# EAGLE design PlanktoscopeHat-v0.2-fab (EAGLE 9.6.2)
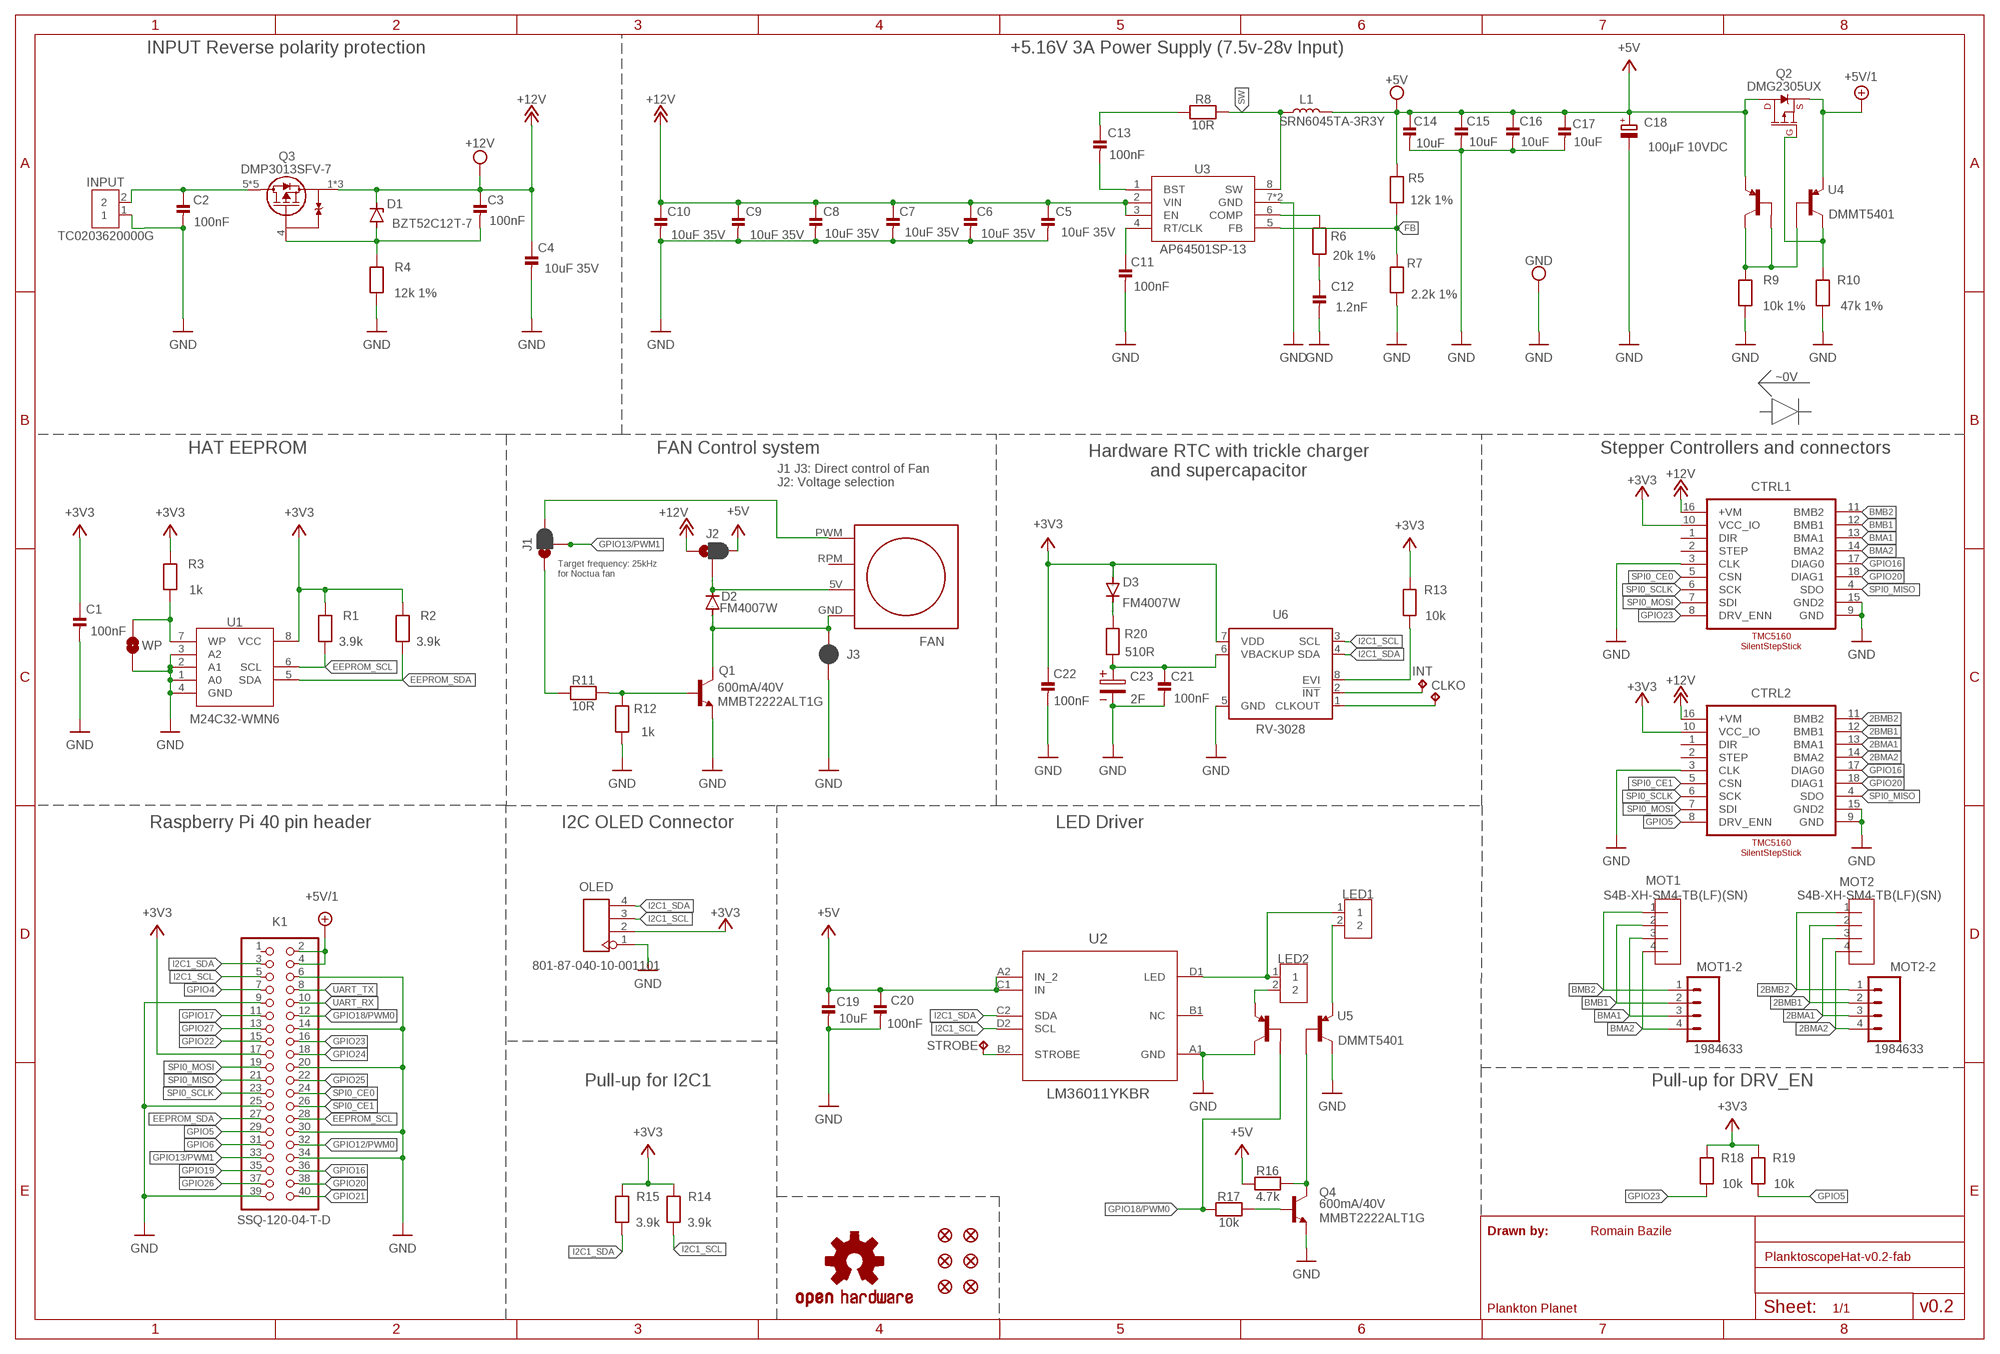
[diagram p0: schematic, sheet 1]

## Parts
+5V  TESTPOINTPAD2MM  [TESTPOINT_PAD_2MM]
+12V  TESTPOINTPAD2MM  [TESTPOINT_PAD_2MM]
C1  100nF  CAP_CERAMIC_0805MP  [_0805MP]
C2  100nF  CAP_CERAMIC_0805MP  [_0805MP]
C3  100nF  CAP_CERAMIC_0805MP  [_0805MP]
C4  10uF 35V  CAP_CERAMIC_0805MP  [_0805MP]
C5  10uF 35V  CAP_CERAMIC_0805MP  [_0805MP]
C6  10uF 35V  CAP_CERAMIC_0805MP  [_0805MP]
C7  10uF 35V  CAP_CERAMIC_0805MP  [_0805MP]
C8  10uF 35V  CAP_CERAMIC_0805MP  [_0805MP]
C9  10uF 35V  CAP_CERAMIC_0805MP  [_0805MP]
C10  10uF 35V  CAP_CERAMIC_0805MP  [_0805MP]
C11  100nF  CAP_CERAMIC_0805MP  [_0805MP]
C12  1.2nF  CAP_CERAMIC_0805MP  [_0805MP]
C13  100nF  CAP_CERAMIC_0805MP  [_0805MP]
C14  10uF  CAP_CERAMIC_0805MP  [_0805MP]
C15  10uF  CAP_CERAMIC_0805MP  [_0805MP]
C16  10uF  CAP_CERAMIC_0805MP  [_0805MP]
C17  10uF  CAP_CERAMIC_0805MP  [_0805MP]
C18  100µF 10VDC  C-POL_TANTALUM-2412(6032-METRIC)  [CAPMP6032X280N]
C19  10uF  CAP_CERAMIC_0805MP  [_0805MP]
C20  100nF  CAP_CERAMIC_0805MP  [_0805MP]
C21  100nF  CAP_CERAMIC_0805MP  [_0805MP]
C22  100nF  CAP_CERAMIC_0805MP  [_0805MP]
C23  2F  WCAP-PTHT_8X8_870135174001  [8X3.5X0.9(DXAXB)]
CLKO  TPB1,27  [B1,27]
CTRL1  TMC5160_SILENTSTEPSTICK  [TMC5160_STEPSTICK]
CTRL2  TMC5160_SILENTSTEPSTICK  [TMC5160_STEPSTICK]
D1  BZT52C12T-7  ZENER_SODFL(1608-METRIC)  [SODFL1608X70]
D2  FM4007W  DIODE-DO-214AC  [DO-214AC]
D3  FM4007W  DIODE-DO-214AC  [DO-214AC]
FAN  40MM_FAN  [40MM_FAN]
FD1  FIDUCIAL1X2  [FIDUCIAL-1X2]
FD2  FIDUCIAL1X2  [FIDUCIAL-1X2]
FD3  FIDUCIAL1X2  [FIDUCIAL-1X2]
FD4  FIDUCIAL1X2  [FIDUCIAL-1X2]
FD5  FIDUCIAL1X2  [FIDUCIAL-1X2]
FD6  FIDUCIAL1X2  [FIDUCIAL-1X2]
GND  TESTPOINTPAD2MM  [TESTPOINT_PAD_2MM]
INPUT  TC0203620000G  2828XX-2282837-2  [TERMBLK_508-2N]
INT  TPB1,27  [B1,27]
J1  JUMPER-SMT_3_1-NC_PASTE_SILK  [SMT-JUMPER_3_1-NC_PASTE_SILK]
J2  JUMPER-SMT_3_1-NC_PASTE_SILK  [SMT-JUMPER_3_1-NC_PASTE_SILK]
J3  JUMPER-SMT_2_NC_PASTE_SILK  [SMT-JUMPER_2_NC_PASTE_SILK]
K1  SSQ-120-04-T-D  PINHD-2X20  [2X20]
L1  SRN6045TA-3R3Y  INDUCTOR-SRN6045-33UH  [SRN6045]
LED1  2828XX-2282834-2  [TERMBLK_254-2N]
LED2  2828XX-2282834-2  [TERMBLK_254-2N]
LOGO1  OSHW-LOGOL  [OSHW-LOGO-L]
MOT1  S4B-XH-SM4-TB(LF)(SN)  [CONN_S4B-XH-SM4-TB_JST]
MOT1-2  1984633  CONN_04SCREW  [SCREWTERMINAL-3.5MM-4]
MOT2  S4B-XH-SM4-TB(LF)(SN)  [CONN_S4B-XH-SM4-TB_JST]
MOT2-2  1984633  CONN_04SCREW  [SCREWTERMINAL-3.5MM-4]
OLED  801-87-040-10-001101  DIP-BLACK-MALE-HEADER-VERT(4P-2.54)  [H4-2.54]
Q1  600mA/40V  TRANS_NPN-MMBT2222AL  [SOT23-3]
Q2  DMG2305UX  MOSFET_PCH-DMG2305UX-7  [SOT23-3]
Q3  DMP3013SFV-7  [POWERDI3333-8_UX_DIO]
Q4  600mA/40V  TRANS_NPN-MMBT2222AL  [SOT23-3]
R1  3.9k  RESISTOR_0805MP  [_0805MP]
R2  3.9k  RESISTOR_0805MP  [_0805MP]
R3  1k  RESISTOR_0805MP  [_0805MP]
R4  12k 1%  RESISTOR_0805MP  [_0805MP]
R5  12k 1%  RESISTOR_0805MP  [_0805MP]
R6  20k 1%  RESISTOR_0805MP  [_0805MP]
R7  2.2k 1%  RESISTOR_0805MP  [_0805MP]
R8  10R  RESISTOR_0805MP  [_0805MP]
R9  10k 1%  RESISTOR_0805MP  [_0805MP]
R10  47k 1%  RESISTOR_0805MP  [_0805MP]
R11  10R  RESISTOR_0805MP  [_0805MP]
R12  1k  RESISTOR_0805MP  [_0805MP]
R13  10k  RESISTOR_0805MP  [_0805MP]
R14  3.9k  RESISTOR_0805MP  [_0805MP]
R15  3.9k  RESISTOR_0805MP  [_0805MP]
R16  4.7k  RESISTOR_0805MP  [_0805MP]
R17  10k  RESISTOR_0805MP  [_0805MP]
R18  10k  RESISTOR_0805MP  [_0805MP]
R19  10k  RESISTOR_0805MP  [_0805MP]
R20  510R  RESISTOR_0805MP  [_0805MP]
STROBE  TPTP15R  [TP15R]
U1  M24C32-WMN6  [SO-8_STM]
U2  LM36011YKBR  [YKB0008AGAG]
U3  AP64501SP-13  AP64500SP-13  [SO-8EP_DIO]
U4  DMMT5401  DDMT5401  [SOT26]
U5  DMMT5401  DDMT5401  [SOT26]
U6  RV-3028  [RV-3028]
WP  JUMPER-SMT_2_NO_SILK  [SMT-JUMPER_2_NO_SILK]

## Nets
2BMA1: CTRL2.13(BMA1) MOT2-2.3 MOT2.3
2BMA2: CTRL2.14(BMA2) MOT2-2.4 MOT2.4
2BMB1: CTRL2.12(BMB1) MOT2-2.2 MOT2.2
2BMB2: CTRL2.11(BMB2) MOT2-2.1 MOT2.1
+3V3: C1.1 C22.1 CTRL1.10(VCC_IO) CTRL2.10(VCC_IO) D3.A K1.17 OLED.2 R1.2 R2.2 R3.2 R13.2 R14.2 R15.2 R18.2 R19.2 U1.8(VCC) U6.7(VDD)
+5V: +5V.P$1 C14.1 C15.1 C16.1 C17.1 C18.1(+) C19.1 C20.1 J2.3 L1.2 Q2.3(D) R5.2 R16.2 U2.A2(IN_2) U2.C1(IN) U4.D1
+5V/1: K1.2 K1.4 Q2.2(S) U4.S1
+12V: +12V.P$1 C3.1 C4.1 C5.1 C6.1 C7.1 C8.1 C9.1 C10.1 CTRL1.16(+VM) CTRL2.16(+VM) D1.1(C) J2.1 Q3.1(S) Q3.2(S) Q3.3(S) U3.2(VIN) U3.3(EN)
/GPIO18: Q4.3(C) R16.1 U5.G2
/INT: INT.TP U6.2(!INT)
BMA1: CTRL1.13(BMA1) MOT1-2.3 MOT1.3
BMA2: CTRL1.14(BMA2) MOT1-2.4 MOT1.4
BMB1: CTRL1.12(BMB1) MOT1-2.2 MOT1.2
BMB2: CTRL1.11(BMB2) MOT1-2.1 MOT1.1
BST: C13.2 U3.1(BST)
CLKOUT: CLKO.TP U6.1(CLKOUT)
COMP: R6.2 U3.6(COMP)
EEPROM_SCL: K1.28 R1.1 U1.6(SCL)
EEPROM_SDA: K1.27 R2.1 U1.5(SDA)
FB: R5.1 R7.2 U3.5(FB)
GND: C1.2 C2.2 C4.2 C5.2 C6.2 C7.2 C8.2 C9.2 C10.2 C11.2 C12.2 C14.2 C15.2 C16.2 C17.2 C18.2(-) C19.2 C20.2 C21.2 C22.2 C23.2 CTRL1.3(CLK) CTRL1.9(GND) CTRL1.15(GND2) CTRL2.3(CLK) CTRL2.9(GND) CTRL2.15(GND2) GND.P$1 INPUT.1 J3.1 K1.6 K1.9 K1.14 K1.20 K1.25 K1.30 K1.34 K1.39 OLED.1 Q1.2(E) Q4.2(E) R4.1 R7.1 R9.1 R10.1 R12.1 U1.1(A0) U1.2(A1) U1.3(A2) U1.4(GND) U2.A1(GND) U3.7(GND) U3.EPAD(GND) U5.D2 U5.G1 U6.5(GND) WP.1
GPIO4: K1.7
GPIO5: CTRL2.8(DRV_ENN) K1.29 R19.1
GPIO6: K1.31
GPIO12/PWM0: K1.32
GPIO13/PWM1: J1.2 K1.33
GPIO16: CTRL1.17(DIAG0) CTRL2.17(DIAG0) K1.36
GPIO17: K1.11
GPIO18/PWM0: K1.12 R17.1 U5.S2
GPIO19: K1.35
GPIO20: CTRL1.18(DIAG1) CTRL2.18(DIAG1) K1.38
GPIO21: K1.40
GPIO22: K1.15
GPIO23: CTRL1.8(DRV_ENN) K1.16 R18.1
GPIO24: K1.18
GPIO25: K1.22
GPIO26: K1.37
GPIO27: K1.13
I2C1_SCL: K1.5 OLED.3 R14.1 U2.D2(SCL) U6.3(SCL)
I2C1_SDA: K1.3 OLED.4 R15.1 U2.C2(SDA) U6.4(SDA)
LED: LED1.1 LED2.1 U2.D1(LED)
LED1OUT: LED1.2 U5.S1
LED2OUT: LED2.2 U5.D1
N$3: R3.1 U1.7(WP) WP.2
N$5: STROBE.TP U2.B2(STROBE)
N$6: C3.2 D1.2(A) Q3.4(G) R4.2
N$8: D2.A FAN.GND J3.2 Q1.3(C)
N$10: C13.1 R8.2
N$12: Q2.1(G) R10.2 U4.D2
N$14: C12.1 R6.1
N$15: R9.2 U4.G1 U4.G2 U4.S2
N$16: D2.C FAN.5V(+5V) J2.2
N$17: Q1.1(B) R11.2 R12.2
N$18: J1.1 R11.1
N$19: FAN.PWM J1.3
N$20: D3.C R20.2
N$21: R13.1 U6.8(EVI)
N$25: Q4.1(B) R17.2
RT: C11.1 U3.4(RT/CLK)
SPI0_CE0: CTRL1.5(CSN) K1.24
SPI0_CE1: CTRL2.5(CSN) K1.26
SPI0_MISO: CTRL1.4(SDO) CTRL2.4(SDO) K1.21
SPI0_MOSI: CTRL1.7(SDI) CTRL2.7(SDI) K1.19
SPI0_SCLK: CTRL1.6(SCK) CTRL2.6(SCK) K1.23
SW: L1.1 R8.1 U3.8(SW)
UART_RX: K1.10
UART_TX: K1.8
VBACKUP: C21.1 C23.1 R20.1 U6.6(VBACKUP)
VIN: C2.1 INPUT.2 Q3.5(D) Q3.6(D) Q3.7(D) Q3.8(D) Q3.9(D)
Unconnected: CTRL1.1(DIR) CTRL1.2(STEP) CTRL2.1(DIR) CTRL2.2(STEP) FAN.RPM K1.1 U2.B1(NC)

## Notes on the sheet
- INPUT Reverse polarity protection | +5.16V 3A Power Supply (7.5v-28v Input)
- ~0V
- HAT EEPROM | FAN Control system | Stepper Controllers and connectors
- Hardware RTC with trickle charger
  and supercapacitor
- J1 J3: Direct control of Fan
  J2: Voltage selection
- Target frequency: 25kHz
  for Noctua fan
- Raspberry Pi 40 pin header | I2C OLED Connector | LED Driver
- Pull-up for I2C1 | Pull-up for DRV_EN
- Drawn by: | Romain Bazile
- Plankton Planet | v0.2

## Library data of the parts
+5V +12V GND = microbuilder:TESTPOINT: Test Point Various test points for characterisation and PCB testing TESTPOINT_SMT - Compact Surface Mount Test Point [Digikey: 5016KTR-ND]
C1-C17 C19-C22 = microbuilder:CAP_CERAMIC: Ceramic Capacitors For new designs, use the packages preceded by an '_' character since they are more reliable: The following footprints should be used on most boards: _0402 - Standard footprint for regular board layouts _0603 - Standard footprint for regular board layouts _0805 - Standard footprint for regular board layouts _1206 - Standard footprint for regular board layouts For extremely tight-pitch boards where space is at a premium, the following 'micro-pitch' footprints can be used (smaller pads, no silkscreen outline, etc.): _0402MP - Micro-pitch footprint for very dense/compact boards _0603MP - Micro-pitch footprint for very dense/compact boards _0805MP - Micro-pitch footprint for very dense/compact boards _1206MP - Micro-pitch footprint for very dense/compact boards
C18 = Capacitor:C-POL: Capacitor Polarised - Generic; CATEGORY: Capacitor; MPN: TPSC107K010T0200
C23 = Wurth_Elektronik_Passive_Capacitors_rev19a:WCAP-PTHT: WCAP-PTHT Aluminum Polymer Capacitors Characteristics Aluminum Polymer Capacitor Recommended soldering: Wave Operating temperature: -55°C to +125°C +125°C product series Low ESR at high frequency range Long life: 2000h @ +125°C Package name and Variant abbreviation: Package: D X A X B = Diameter of the outline X Pitch of the hole X Diameter of the hole. <http://katalog.we-online.de/media/images/eisos/WCAP-PTHT_pf2.jpg> Details see: http://katalog.we-online.de/en/pbs/WCAP-PTHT/ Created: 2015-02-06 2015 (C) Wurth Elektronik; MPN: SCCR12E105SRB; WE-NUMBER: 870135174001/390uF
CLKO INT STROBE = testpad:TP: Test pad
CTRL1 CTRL2 = PScope:TMC5160_SILENTSTEPSTICK
D1 = Diode:ZENER: Zener Diode - Generic; CATEGORY: Diode; SUB-CATEGORY: Zener; VALUE: ZENER
D2 D3 = diode:DIODE-: DIODE
FAN = PScope:40MM_FAN
FD1-FD6 = SparkFun-Aesthetics:FIDUCIAL: Fiducial Alignment Points Point-of-reference for pick-and-place machines and other optical instruments.
INPUT = Connector:2828XX-2: 2 Position Wire to Board Terminal Block Horizontal with Board Datasheet <https://www.te.com.cn/commerce/DocumentDelivery/DDEController?Action=showdoc&DocId=Catalog+Section%7F1308389_EUROSTYLE_TERMINAL_BLOCKS%7F0607%7Fpdf%7FEnglish%7FENG_CS_1308389_EUROSTYLE_TERMINAL_BLOCKS_0607.pdf%7F2-282837-5>; CATEGORY: Connector; DESCRIPTION: 2 Position Wire to Board Terminal Block Horizontal with Board 5.08 mm Through Hole; MANUFACTURER: TE Connectivity; MPN: TC0203620000G; OPERATING_TEMPERATURE: -40°C to +105°C; PART_STATUS: ACTIVE; ROHS_COMPLIANCE: RoHS Compliant; SERIES: 282837; SUBCATEGORY: Terminal Block; TYPE: Side Wire Entry
J1 J2 = SparkFun-Jumpers:JUMPER-SMT_3_1-NC_PASTE: Normally closed solder jumper (1 of 2 connections) This jumper has an aperture in the stencil to allow solder paste to bridge one of the two connections. One connection is normally closed (NC), while the other is normally open (NO). Wick off the solder to open the connection. Reapply solder to reclose the connection. Apply solder to the other side instead to change the current path.
J3 = SparkFun-Jumpers:JUMPER-SMT_2_NC_PASTE: Normally closed solder jumper This jumper has an aperture in the stencil to allow solder paste to bridge the split in the wire so it's normally closed (NC). Wick off the solder to open the connection. Reapply solder to reclose the connection.
K1 = Connector:PINHD-2X20: PIN HEADER; CATEGORY: CONNECTOR; SUB-CATEGORY: PIN-HEADER
L1 = SparkFun-Coils:INDUCTOR: Inductors Resist changes in electrical current. Basically a coil of wire. SparkFun Products: SparkFun Load Cell Amplifier - HX711 <https://www.sparkfun.com/products/13879> IOIO-OTG - V2.2 <https://www.sparkfun.com/products/13613>; PROD_ID: NDUC-11627; VALUE: 33µH/±20%/1.4A
LED1 LED2 = Connector:2828XX-2: 2 Position Wire to Board Terminal Block Horizontal with Board Datasheet <https://www.te.com.cn/commerce/DocumentDelivery/DDEController?Action=showdoc&DocId=Catalog+Section%7F1308389_EUROSTYLE_TERMINAL_BLOCKS%7F0607%7Fpdf%7FEnglish%7FENG_CS_1308389_EUROSTYLE_TERMINAL_BLOCKS_0607.pdf%7F2-282837-5>
LOGO1 = SparkFun-Aesthetics:OSHW-LOGO: Open-Source Hardware (OSHW) Logo This logo indicates the piece of hardware it is found on incorporates a OSHW license and/or adheres to the definition of open source hardware found here: http://freedomdefined.org/OSHW
MOT1 MOT2 = PScope:S4B-XH-SM4-TB(LF)(SN); BUILT_BY: EMA_Justin; COPYRIGHT: Copyright (C) 2018 Accelerated Designs. All rights reserved; DATASHEET: http://www.farnell.com/datasheets/1684882.pdf?_ga=2.23206330.1695985900.1582574926-861621671.1572890216&_gac=1.58313304.1582574926.CjwKCAiAhc7yBRAdEiwAplGxX0eXyKiGfj62eRMGG7KvwS8fdWH6vWjmriwTUSfyzPNlkVLVCkx_YhoCwGcQAvD_BwE; MANUFACTURER_PART_NUMBER: S4B-XH-SM4-TB(LF)(SN); MPN: S4B-XH-SM4-TB(LF)(SN); SOURCELIBRARY: JST_2020-02-24; VENDOR: JST
MOT1-2 MOT2-2 = SparkFun-Connectors:CONN_04: Multi connection point. Often used as Generic Header-pin footprint for 0.1 inch spaced/style header connections On any of the 0.1 inch spaced packages, you can populate with these: Break Away Headers - Straight <https://www.sparkfun.com/products/116> (PRT-00116) Break Away Male Headers - Right Angle <https://www.sparkfun.com/products/553> (PRT-00553) Female Headers <https://www.sparkfun.com/products/115> (PRT-00115) Break Away Headers - Machine Pin <https://www.sparkfun.com/products/117> (PRT-00117) Break Away Female Headers - Swiss Machine Pin <https://www.sparkfun.com/products/743> (PRT-00743) For SCREWTERMINALS and SPRING TERMINALS visit here: Screw Terimnals on SparkFun.com <https://www.sparkfun.com/search/results?term=Screw+Terminals> (5mm/3.5mm/2.54mm spacing) This device is also useful as a general connection point to wire up your design to another part of your project. Our various solder wires solder well into these plated through hole pads. Hook-Up Wire - Assortment (Stranded, 22 AWG) <https://www.sparkfun.com/products/11375> (PRT-11375) Hook-Up Wire - Assortment (Solid Core, 22 AWG) <https://www.sparkfun.com/products/11367> (PRT-11367) View the entire wire category on our website here <https://www.sparkfun.com/categories/141> Special notes: Molex polarized connector foot print use with SKU : PRT-08231 with associated crimp pins and housings. 1MM SMD Version SKU: PRT-10208; PROD_ID: 2xCONN-08399; SF_ID: 2xPRT-08084
OLED = OPL_Connector:DIP-BLACK-MALE-HEADER-VERT(4P-2.54): 320020017; MPN: P125-1104A0BS116A1; VALUE: 4p-2.54
Q1 Q4 = SparkFun-DiscreteSemi:TRANS_NPN: NPN transistor Current controlled devices typically used to amplify current or used as a switch. BC547 - COM-08928 <http://www.sparkfun.com/products/8928> (TO-92 45V 100mA) (1.Collector 2.Base 3.Emitter) 2N3904 - COM-00521 <http://www.sparkfun.com/products/521> (TO-92 40V 200mA) (1.Emitter 2.Base 3.Collector) P2N2222A - COM-12852 <http://www.sparkfun.com/products/12852> (TO-92 40V 600mA) (1.Collector 2.Base 3.Emitter); MPN: MMBT2222ALT1G; PROD_ID: TRANS-08049
Q2 = SparkFun-DiscreteSemi:MOSFET_PCH: P-channel MOSFETs Voltage controlled devices that allow control of high current outputs. SparkFun Products: SparkFun ESP32 Thing <https://www.sparkfun.com/products/13907> SparkFun ESP8266 Thing <https://www.sparkfun.com/products/13231> SparkFun Pi Servo HAT V2 <https://www.sparkfun.com/products/15316> DMG2305UX-7 (20V/4.2A/SOT23-3); PROD_ID: TRAN-14388; VALUE: 20V/4.2A/52mΩ/1.4W
Q3 = PScope:DMP3013SFV-7; BUILT_BY: EMA_Cory; COPYRIGHT: Copyright (C) 2018 Accelerated Designs. All rights reserved; DATASHEET: https://www.diodes.com/assets/Datasheets/DMP3013SFV.pdf; MANUFACTURER_PART_NUMBER: DMP3013SFV-7; SOURCELIBRARY: Diodes_Inc_2020-06-18; VENDOR: Diodes Inc
R1-R20 = microbuilder:RESISTOR: Resistors For new designs, use the packages preceded by an '_' character since they are more reliable: The following footprints should be used on most boards: _0402 - Standard footprint for regular board layouts _0603 - Standard footprint for regular board layouts _0805 - Standard footprint for regular board layouts _1206 - Standard footprint for regular board layouts For extremely tight-pitch boards where space is at a premium, the following 'micro-pitch' footprints can be used (smaller pads, no silkscreen outline, etc.): _0402MP - Micro-pitch footprint for very dense/compact boards _0603MP - Micro-pitch footprint for very dense/compact boards _0805MP - Micro-pitch footprint for very dense/compact boards _1206MP - Micro-pitch footprint for very dense/compact boards
U1 = PScope:M24C32-WMN6; BUILT_BY: EMA_UL_Team; MANUFACTURER_PART_NUMBER: M24C32-WMN6; SOURCELIBRARY: StMicro_2011-06-07; VENDOR: STMicroelectronics
U2 = PScope:LM36011YKBR; MANUFACTURER: Texas Instruments; PARTNUMBER: LM36011YKBR; REFDES: RefDes; TYPE: TYPE; VALUE: Value
U3 = PScope:AP64500SP-13; BUILT_BY: EMA_Cory; COPYRIGHT: Copyright (C) 2018 Accelerated Designs. All rights reserved; DATASHEET: https://www.diodes.com/assets/Datasheets/AP64500.pdf; MANUFACTURER_PART_NUMBER: AP64500SP-13; SOURCELIBRARY: Diodes_Inc_2020-08-19; VENDOR: Diodes Inc
U4 U5 = SparkFun-DiscreteSemi:DDMT5401
U6 = SparkFun-Clocks:RV-3028: RV-3028 - RTC with I2C Bus Specifications: Pin count: 8 Pin pitch: .9mm Area: [3.2mm x 2.0mm] Datasheet referenced for footprint <https://www.microcrystal.com/fileadmin/Media/Products/RTC/App.Manual/RV-3028-C7_App-Manual.pdf>; PROD_ID: IC-14378
WP = SparkFun-Jumpers:JUMPER-SMT_2_NO: Normally open jumper This jumper has two pads in close proximity to each other. Apply solder to close the connection. Round pads are easier to solder for beginners, but are a lot larger. SparkFun Product that uses the round pads: SparkFun EL Sequencer <https://www.sparkfun.com/products/12781>

## Board
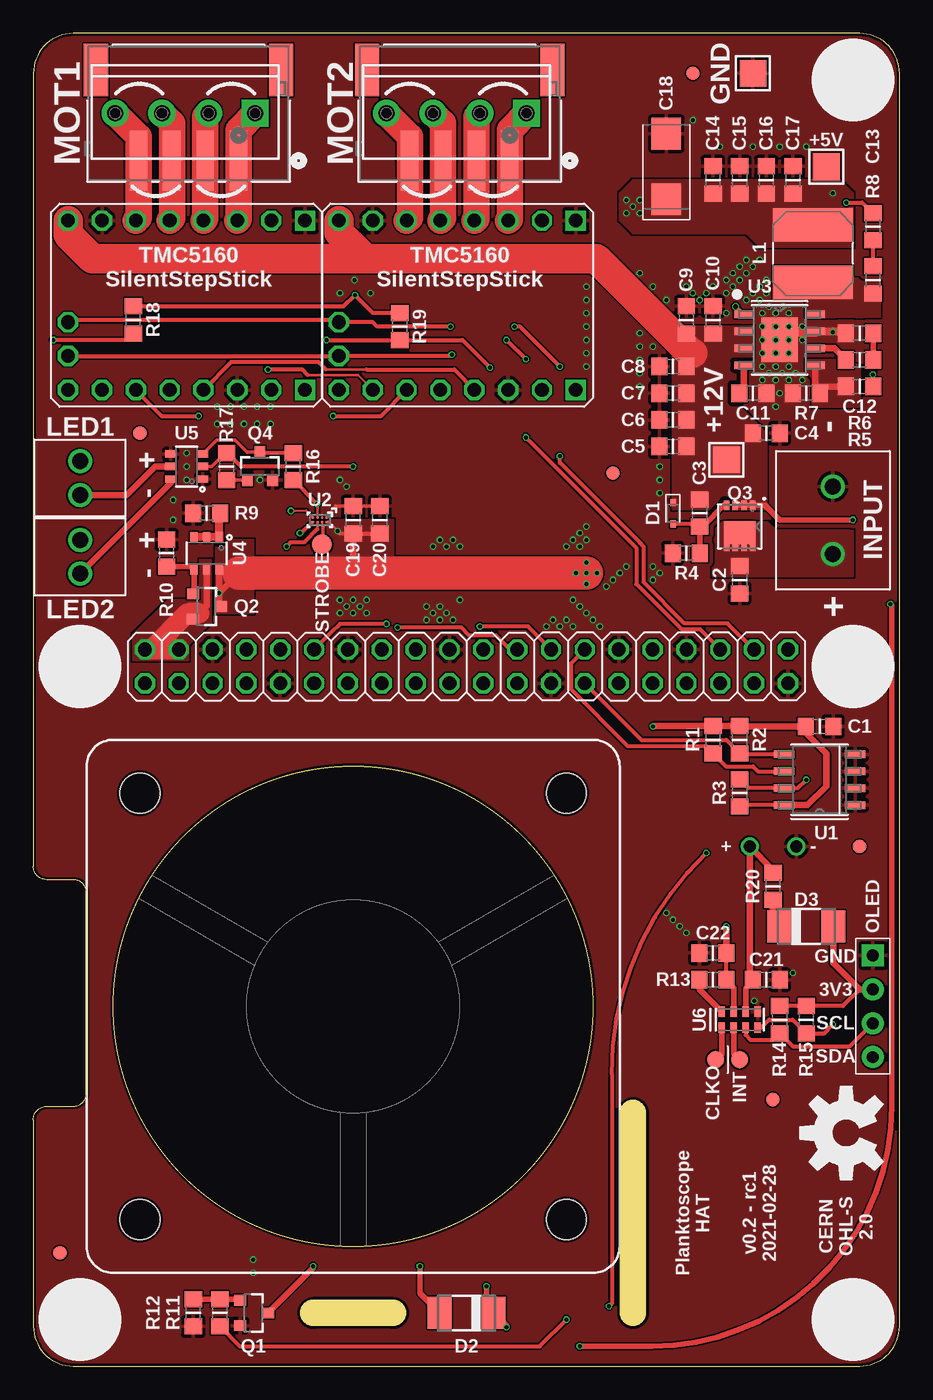
[diagram p1: board, top side]
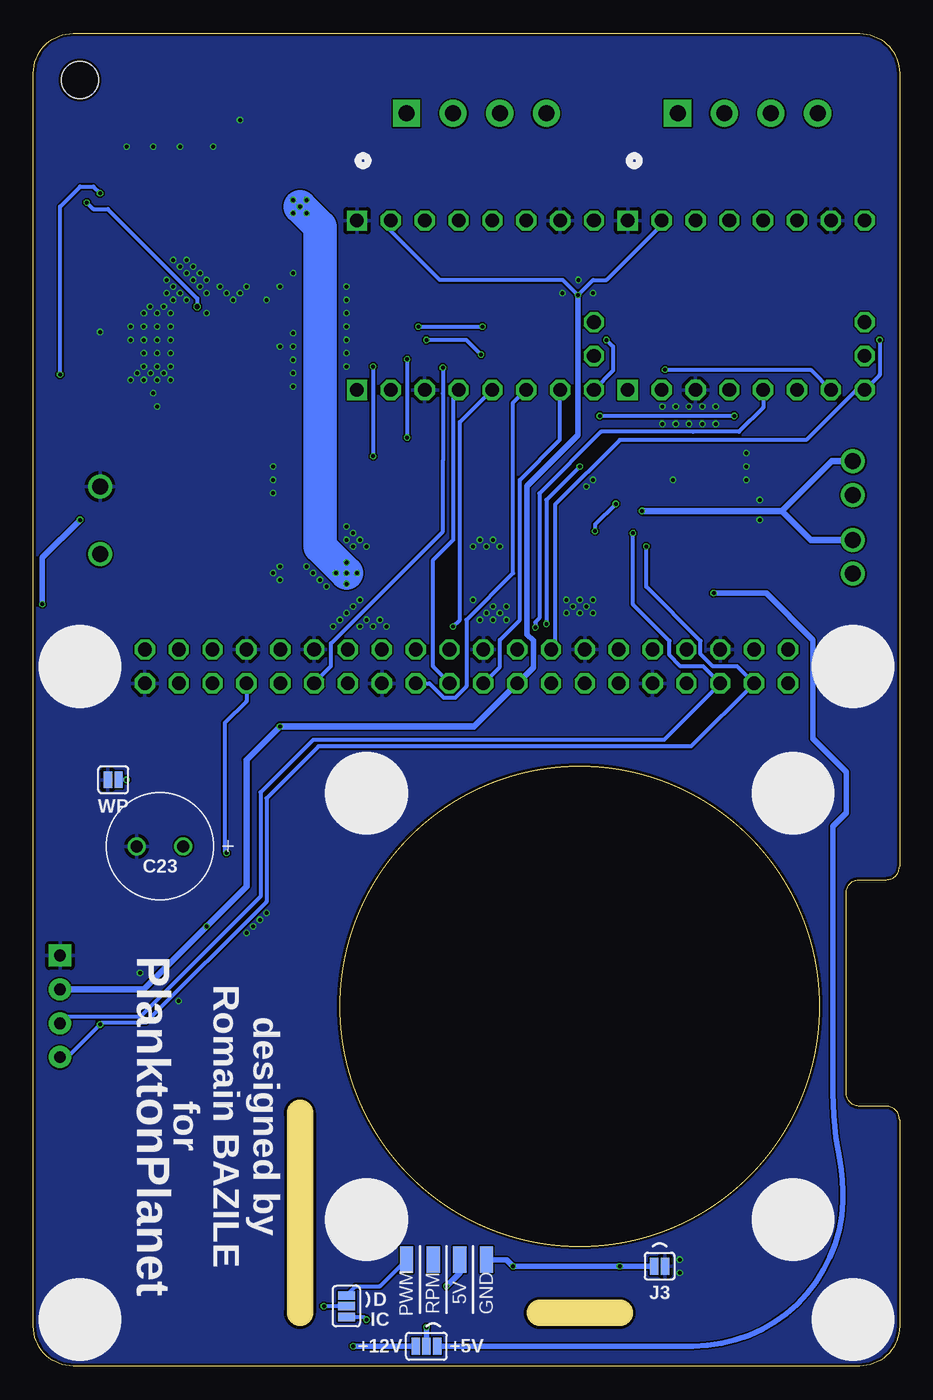
[diagram p2: board, bottom side, seen from below]

Size 65 x 100 mm. Coordinates in mm from the lower left corner, seen from the top.
Outline: 45,19 45,4
Outline: 0,3 arc90 3,0 47,0 62,0 arc90 65,3 65,97 arc90 62,100 3,100 arc90 0,97 0,37.5 arc90 1,36.5 3,36.5 arc-90 4,35.5 4,20.5 arc-90 3,19.5 1,19.5 arc90 0,18.5 0,3
Copper layers (1*16): Top 0.035mm / dielectric 1.6mm / Bottom 0.035mm
Design rules "jlcpcb-2layers_custom *": minimum track width 5mil, minimum drill 0.3mm, track to track 5mil, track to pad 5mil, pad to pad 5mil, via to via 5mil, smd to smd 0mil, copper to edge 0.2mm, drill to drill 6mil, minimum pad ring 5mil, minimum via ring 3mil, stop-mask expansion 4mil, vias tented up to drill 0.3mm, thermal gap 10mil
Holes 2.8 mm at 3.5,3.5 3.5,52.5 61.5,52.5 61.5,3.5 61.5,96.5
Milling: 1 lines

### Footprints (pad centres in the part's own frame; a part is rotated, then mirrored left to right if it is on the bottom)
TESTPOINT_PAD_2MM = smd 2 x 2: P$1 0,0
_0805MP = smd 1.2 x 1.3: 1 -1.016,0; 2 1.016,0
CAPMP6032X280N = smd 2.368 x 2.204: 1 -2.471,0; 2 2.471,0
8X3.5X0.9(DXAXB) = drill 0.9: 1 1.75,0; 2 -1.75,0
B1,27 = smd 1.27 x 1.27: TP 0,0
TMC5160_STEPSTICK = drill 1.016 square: 1 8.89,-6.35; 9 8.89,6.35 | drill 1.016 octagon: 2 6.35,-6.35; 3 3.81,-6.35; 4 1.27,-6.35; 5 -1.27,-6.35; 6 -3.81,-6.35; 7 -6.35,-6.35; 8 -8.89,-6.35; 10 6.35,6.35; 11 3.81,6.35; 12 1.27,6.35; 13 -1.27,6.35; 14 -3.81,6.35; 15 -6.35,6.35; 16 -8.89,6.35; 17 -8.89,-3.81; 18 -8.89,-1.27
SODFL1608X70 = smd 0.538 x 0.4: 1 -0.796,0; 2 0.796,0
DO-214AC = smd 1.8 x 2.4: A 2.025,0; C -2.025,0
40MM_FAN = smd 1 x 2 bottom: 5V -9,19; GND -7,19; PWM -13,19; RPM -11,19 | hole 3: -16,16; 16,16; 16,-16; -16,-16
FIDUCIAL-1X2 = smd 1 x 1: 1 0,0
TERMBLK_508-2N = drill 1.2: 1 0,0; 2 5.08,0
SMT-JUMPER_3_1-NC_PASTE_SILK = smd 0.635 x 1.27: 1 -0.813,0; 2 0,0; 3 0.813,0
SMT-JUMPER_2_NC_PASTE_SILK = smd 0.635 x 1.27: 1 -0.406,0; 2 0.406,0
2X20 = drill 1.016 octagon: 1 -24.13,-1.27; 2 -24.13,1.27; 3 -21.59,-1.27; 4 -21.59,1.27; 5 -19.05,-1.27; 6 -19.05,1.27; 7 -16.51,-1.27; 8 -16.51,1.27; 9 -13.97,-1.27; 10 -13.97,1.27; 11 -11.43,-1.27; 12 -11.43,1.27; 13 -8.89,-1.27; 14 -8.89,1.27; 15 -6.35,-1.27; 16 -6.35,1.27; 17 -3.81,-1.27; 18 -3.81,1.27; 19 -1.27,-1.27; 20 -1.27,1.27; 21 1.27,-1.27; 22 1.27,1.27; 23 3.81,-1.27; 24 3.81,1.27; 25 6.35,-1.27; 26 6.35,1.27; 27 8.89,-1.27; 28 8.89,1.27; 29 11.43,-1.27; 30 11.43,1.27; 31 13.97,-1.27; 32 13.97,1.27; 33 16.51,-1.27; 34 16.51,1.27; 35 19.05,-1.27; 36 19.05,1.27; 37 21.59,-1.27; 38 21.59,1.27; 39 24.13,-1.27; 40 24.13,1.27
SRN6045 = smd 2.5 x 6: 1 -2.175,0; 2 2.125,0
TERMBLK_254-2N = drill 1.2: 1 0,0; 2 2.54,0
CONN_S4B-XH-SM4-TB_JST = smd 1.295 x 4.496: 1 -3.75,3.552; 2 -1.25,3.552; 3 1.25,3.552; 4 3.75,3.552 | smd 1.803 x 3.912: 5 -6.95,-3.248; 6 6.95,-3.248
SCREWTERMINAL-3.5MM-4 = drill 1.2 pad 2.032 square: 1 0,0 | drill 1.2 pad 2.032: 2 3.5,0; 3 7,0; 4 10.5,0
H4-2.54 = drill 0.889 pad 1.651 square: 1 0,3.81 | drill 0.889 pad 1.651: 2 0,1.27; 3 0,-1.27; 4 0,-3.81
SOT23-3 = smd 0.8 x 0.9: 1 -0.95,-1; 2 0.95,-1; 3 0,1.1
POWERDI3333-8_UX_DIO = smd 0.7 x 0.42: 1 -1.598,0.975; 2 -1.598,0.325; 3 -1.598,-0.325; 4 -1.598,-0.975 | smd 0.54 x 0.42: 5 1.578,-0.975; 6 1.578,-0.325; 7 1.578,0.325; 8 1.578,0.975 | smd 1.71 x 2.37: 9 0.455,0
TP15R = smd 1.5 x 1.5: TP 0,0
SO-8_STM = smd 1.538 x 0.558: 1 -2.68,1.905; 2 -2.68,0.635; 3 -2.68,-0.635; 4 -2.68,-1.905; 5 2.68,-1.905; 6 2.68,-0.635; 7 2.68,0.635; 8 2.68,1.905
YKB0008AGAG = smd 0.2 x 0.2: A1 -0.175,0.525; A2 0.175,0.525; B1 -0.175,0.175; B2 0.175,0.175; C1 -0.175,-0.175; C2 0.175,-0.175; D1 -0.175,-0.525; D2 0.175,-0.525
SO-8EP_DIO = smd 1.417 x 0.558: 1 -2.69,1.905; 2 -2.69,0.635; 3 -2.69,-0.635; 4 -2.69,-1.905; 5 2.69,-1.905; 6 2.69,-0.635; 7 2.69,0.635; 8 2.69,1.905 | smd 2.718 x 3.353: EPAD 0,0
SOT26 = smd 0.55 x 0.8: D1 -0.95,1.2; D2 0.95,1.2; G1 -0.95,-1.2; G2 0.95,-1.2; S1 0,1.2; S2 0,-1.2
RV-3028 = smd 0.5 x 0.8: 1 -1.35,-0.6; 2 -0.45,-0.6; 3 0.45,-0.6; 4 1.35,-0.6; 5 1.35,0.6; 6 0.45,0.6; 7 -0.45,0.6; 8 -1.35,0.6
SMT-JUMPER_2_NO_SILK = smd 0.635 x 1.27: 1 -0.406,0; 2 0.406,0

### Placement (x,y rotation side)
+5V  59.5,90 270 top
+12V  52,68 90 top
C1  59,48 0 top
C2  53,59 270 top
C3  50,64 270 top
C4  55,70 0 top
C5  48,69 180 top
C6  48,71 180 top
C7  48,73 180 top
C8  48,75 180 top
C9  49,78.5 90 top
C10  51,78.5 90 top
C11  54,73 0 top
C12  62,77.5 180 top
C13  63,85.5 90 top
C14  51,89 90 top
C15  53,89 90 top
C16  55,89 90 top
C17  57,89 90 top
C18  47.5,90 90 top
C19  24,63.5 90 top
C20  26,63.5 90 top
C21  55,29 0 top
C22  51,31 180 top
C23  55.5,39 0 bottom
CLKO  51.2,23 0 top
CTRL1  11.5,79.6 0 top
CTRL2  31.82,79.6 0 top
D1  48,64 270 top
D2  32.5,4 180 top
D3  58,33 0 top
FAN  24,27 180 top
FD1  2,8.5 0 top
FD2  55.5,20 0 top
FD3  62,39 0 top
FD4  8,70 0 top
FD5  43.5,67 0 top
FD6  49.5,97 0 top
GND  54,97 270 top
INPUT  60,66 270 top
INT  53,23 0 top
J1  41.5,4.5 90 bottom
J2  35.5,1.5 0 bottom
J3  18,7.5 180 bottom
K1  32.5,52.5 0 top
L1  58.5,83.5 90 top
LED1  3.5,67.9 270 top
LED2  3.5,62 270 top
LOGO1  61,17.5 90 top
MOT1  11.65,94 180 top
MOT1-2  16.65,94 180 top
MOT2  32,94 180 top
MOT2-2  37,94 180 top
OLED  63,27 0 top
Q1  16.5,4 270 top
Q2  13,57 270 top
Q3  53,63 270 top
Q4  17,67.5 0 top
R1  51,47 90 top
R2  53,47 90 top
R3  53,43.01 270 top
R4  49,61 0 top
R5  62,73.5 0 top
R6  62,75.5 180 top
R7  58,73 0 top
R8  63,81.5 90 top
R9  13,64 0 top
R10  10,61 270 top
R11  14,4 90 top
R12  12,4 90 top
R13  51,29 0 top
R14  56,26 90 top
R15  58,26 90 top
R16  19.5,67.5 270 top
R17  14.5,67.5 270 top
R18  7.5,78.5 90 top
R19  27.5,78 90 top
R20  55.5,36 270 top
STROBE  21.65,61.65 270 top
U1  59,44 180 top
U2  21.5,63.5 270 top
U3  56,77 0 top
U4  13,61 180 top
U5  11.5,67.5 90 top
U6  53,26 0 top
WP  59,44 0 bottom

### Tracks (layer width: path | path; a pad name or v marks a point on that pad's centre or on a via)
2BMA1
  Top 2: CTRL2.13 30.75,86.12 MOT2.3 30.75,93.25 MOT2-2.3
2BMA2
  Top 2: MOT2-2.4 28.25,92.25 MOT2.4 28.25,86.16 CTRL2.14
2BMB1
  Top 2: CTRL2.12 33.25,86.08 MOT2.2 33.25,93.75 MOT2-2.2
2BMB2
  Top 2: CTRL2.11 35.75,86.04 MOT2.1 35.75,92.75 MOT2-2.1
+3V3  (via drill 0.3)
  Top 0.3: R13.2 C22.1 | U1.8 53.32,42.09 53.21,41.99 R3.2 | 62,28.27 60.75,27.02 R15.2 R14.2 | R19.2 25.48,79.02 v24.13,80.37 23.27,79.52 R18.2
  Top 0.4: U6.7 52.55,28.37 R13.2
  Top 0.5: U1.8 58.09,42.09 59.5,43.5 59.5,45.98 57.98,47.5 C1.1 53.02,48 R2.2 R1.2 46.52,48.02 v46.5,48 | v52,33 52,31.02 C22.1 | D3.A 60.02,30.25 62,28.27 OLED.2
  Bottom 0.3: CTRL2.10 38.2,85.2 34.5,81.5 25.26,81.5 v24.13,80.37 24,80.5 23,81.5 22,81.5 17.84,85.66 17.85,85.67 CTRL1.10
  Bottom 0.4: K1.17 28.65,51.23 27.48,52.41 27.48,54.43 27.95,54.91 27.95,66.05 24.5,69.5 24.13,69.87 v24.13,80.37
  Bottom 0.5: OLED.2 56.73,28.27 v52,33 49,36 49,45.5 v46.5,48 31.92,48 K1.17
+5V  (via drill 0.3)
  Top 0.18: U2.A2 22.21,63.33 22.84,62.69 | U2.C1 21.32,64.67
  Top 0.2: 21.32,64.67 v21.3,64.7
  Top 0.25: C19.1 23,62.48 | v22.84,62.64 22.84,62.69
  Top 0.3: R5.2 63,73.52 v63,74.4 | 23,62.48 v22.84,62.64 | C19.1 C20.1 | R16.2 19.52,66.48 v21.3,64.7
  Top 0.4: 15.45,59.5 v13.95,58 | v41.5,60.3 v42.3,59.5 41.8,59.5 v41.5,59.5 | v41.5,59.5 v41.5,58.7 | v41.5,59.5 v40.7,59.5
  Top 0.5: U4.D1 v13.95,58 13.95,57.15 Q2.3 | C19.1 24,59.5
  Top 2.5: 15.45,59.5 23.5,59.5 24,59.5 v41.5,59.5
  Bottom 0.3: v63,74.4 63,87 61.5,88.5 60.5,88.5 v60,88 | v21.3,64.7 22.84,63.16 v22.84,62.64
  Bottom 0.4: v13.95,58 10,58 6.5,54.5 6.5,47.08 5.32,45.9 4,44.58 4,41.5 5,40.49 5.01,26 5.01,20.5 5,20.5 arc-11 4.5,15.5 arc13 4.25,12.36 arc88 15.5,1.5 17,1.5 17.5,1.5 25.3,1.5 J2.3
  Bottom 2.5: v41.5,59.5 43.5,61.5 43.5,85.5 v45,87
  other vias: 44.5,86.5 45.5,87.5 44.5,87.5 45.5,86.5
  pour Top (no thermals): 60.5,89 61.5,88 61.5,84 54.5,84 53.5,85 45,85 44,86 44,88 45,89
  pour Top (isolate 0.3, no thermals): 13.7,56.5 16.5,56.5 16.5,62 13.7,62
  pour Top (no thermals): 22,63.5 27,63.5 27,59.5 22,59.5
+5V/1
  Top 0.5: U4.S1 13,57.05 12.47,56.52 12.45,56.5 Q2.2
  Top 1.5: 12.45,56.5 11.6,56.5 8.87,53.77 K1.2 K1.4
  pour Top (no thermals): 10.1,57.5 11.3,57.5 12.5,58.7 12.5,60.5 13.3,60.5 13.3,55.8 11.6,54.1 11.6,53 7.5,53 7.5,54.9
+12V  (via drill 0.3)
  Top 0.4: Q3.3 Q3.2 Q3.1 54.9,64.6 56,63.5 v61.5,63.5 | v64.32,57.18 64.42,57.08 64.42,19.5 arc-90 46.42,1.5 v41,1.5
  Top 2.2: CTRL1.16 2.61,84.89 4.4,83.1 24.9,83.1 | 49.5,76 49.35,76 47.43,77.93 42.25,83.1 24.9,83.1 | CTRL2.16 22.96,85.04 24.5,83.5 24.9,83.1
  Bottom 0.4: v64.32,57.18 64.32,60.68 v61.5,63.5 | J2.1 v41,1.5
  pour Top (isolate 0.3, no thermals): 53,75 53,72 55,70 55,64.3 48,64.3 48,78 54,78 54,75
/GPIO18
  Top 0.25: U5.G2 13.75,69.5 15.16,69.5 16.06,68.6 Q4.3
  Top 0.3: R16.1 17.08,68.52 Q4.3
/INT
  Top 0.4: U6.2 52.55,23.45 INT.TP
BMA1
  Top 2: CTRL1.13 10.4,86.12 MOT1.3 10.4,93.25 MOT1-2.3
BMA2
  Top 2: CTRL1.14 7.9,86.16 MOT1.4 7.9,92.25 MOT1-2.4
BMB1
  Top 2: CTRL1.12 12.9,86.08 MOT1.2 12.9,93.75 MOT1-2.2
BMB2
  Top 2: CTRL1.11 15.4,86.04 MOT1.1 15.4,92.75 MOT1-2.1
BST  (via drill 0.3, 0.35)
  Top 0.3: v52.7,79.5 U3.1 | v60.99,87.31 62.19,87.31 62.98,86.52 C13.2
  Bottom 0.3: v52.7,79.5 52.7,80.1 59.41,86.81 60.49,86.81 v60.99,87.31
CLKOUT
  Top 0.4: U6.1 51.65,23.45 CLKO.TP
COMP
  Top 0.5: U3.6 60.12,76.36 R6.2
EEPROM_SCL
  Top 0.3: K1.28 40.33,52.71 40.33,51 | 40.33,50.79 40.33,51 | 40.33,51 40.33,50.79 | 40.33,50.79 44.57,46.55 50.44,46.55 R1.1 51.98,45 54,45 54.37,44.63 U1.6
EEPROM_SDA
  Top 0.3: K1.27 45.62,47 52,47 53,46 R2.1 53.08,45.91 U1.5
FB
  Top 0.5: U3.5 58.69,75 58.69,74 58.69,73.5 | 58.69,73.5 58.69,73.23 R7.2 | R5.1 58.69,73.5
  pour Top (no thermals): 58,75.5 61.5,75.5 62,75 62,72 58.5,72 58.5,74.1 58,74.6
GND  (via drill 0.3)
  Top 0.18: U2.A1 22.02,63.88
  Top 0.2: 22.67,64.52 22.02,63.88
  Top 0.25: 22.67,64.52 C19.2 C20.2
  Top 0.5: 55.7,77.64 v55.7,77
  Top 0.6: C12.2 60.9,77.64 U3.7
  Top 0.8: U3.7 55.7,77.64
  other vias: 54.7,79 55.7,79 55.7,75 56.7,75 54.7,75 56.7,79 57.7,77 60,77.6 54.7,78 54.7,77 54.7,76 55.7,78 55.7,76 56.7,76 56.7,77 56.7,78 57.7,78 55.7,74 56.7,74 56,73 45.5,82 53.5,83 50,80 51,81 52.5,82 52,80.5 53,81.5 54,82.5 40,56 42,56 42.5,55.5 31,61.5 40.5,57.5 43.5,59 40.5,62 30,61.5 31.5,56 47,67.5 47,66.5 47,65.5 54.5,83 49,81 58,91.5 56,91.5 54,91.5 49.5,93.5 51.5,91.5 39,56 39.5,55.5 40.5,55.5 54.7,74 57.7,74 55.7,72 57.2,74.5 41.5,78 54.1,27.4 57,29.5 41.5,79 41.5,80 41.5,81 38.5,55.5 41,57 40,61.5 41,61.5 41,62.5 43,58.5 44,59.5 44.5,60 29.5,56 41.5,62 14.8,72 15.8,72 14.8,70.7 15.8,70.7 16.8,70.7 16.8,72 13.8,72 13.8,70.7 17.8,72 17.8,70.7 24.1,81.5 25.3,80.5 23,80.5 41.5,77 41.5,76 41.5,75 45.5,76.5 45.5,75.5 45.5,74.5 45.5,73.5 45.5,77.5 52.5,81 53.5,82 54.5,81 54,80.5 55,81.5 53,82.5 55,80.5 54.5,80 53.5,80 52,81.5 55.2,79.5 56.25,79.5 30.5,56 29.5,57 30.5,57 30,56.5 31,56.5 25,57.5 25,56.5 24.5,57 24,56.5 24,57.5 23.5,57 23,56.5 23,57.5 23,66.5 32,61.5 31.5,62 30.5,62 32,57.5 11.5,68.5 11.5,67.5 11.5,66.5 46.5,59 46.5,60 47,59.5 41.5,56.5 41.5,63 46.5,81 46.5,76.5 50.5,80.5 49.5,80.5 52,79 47.5,80 56.2,74.5 55.2,74.5 23.5,66 17,66.5 10.5,63.5 10.5,65 47.5,34 48,33.5 48.5,33 49,32.5 16.5,8 16.5,7
  pour Bottom: 0,3 arc90 3,0 62,0 arc90 65,3 65,97 arc90 62,100 3,100 arc90 0,97
  pour Top (rank 2): 0,3 arc90 3,0 62,0 arc90 65,3 65,97 arc90 62,100 3,100 arc90 0,97
  pour Top (rank 2, no thermals): 52,81 63.5,81 63.5,71.5 52,71.5
GPIO5  (via drill 0.3)
  Top 0.3: v34.27,74.91 32.2,76.98 R19.1 27.48,77 v22,77
  Bottom 0.3: K1.29 43.93,51.27 42.67,52.53 42.67,54.23 34.27,62.63 34.27,67.93 34.27,73 v34.27,74.91 | v22,77 21.5,76.5 21.5,74.71 CTRL2.8
GPIO13/PWM1  (via drill 0.3)
  Top 0.3: v43.2,4.5 43.4,4.7 43.4,21.93 arc-46 v50.5,38.5
  Bottom 0.3: K1.33 49.01,49.88 50.63,48.26 50.63,38.63 v50.5,38.5 | J1.2 v43.2,4.5
GPIO16  (via drill 0.3)
  Top 0.3: K1.36 50.05,55.27 48.65,55.27 45.25,58.67 45.25,61.39 v36.95,69.69 | v35.5,77 v36.95,75.55 | v31.4,75.9 31.31,75.81 22.98,75.81 CTRL2.17 CTRL1.17
  Bottom 0.3: v36.95,75.55 v36.95,69.69 | v31.4,75.9 32.5,77 v35.5,77
GPIO18/PWM0  (via drill 0.3)
  Top 0.25: U5.S2 13.38,67.5 14.4,68.52 R17.1
  Top 0.3: v26.5,55.7 26.2,55.7 23,55.7 22.3,55 K1.12 | v24,67.5 15.6,67.5 14.58,68.52 R17.1
  Bottom 0.3: v24,67.5 26.5,65 v26.5,55.7
GPIO20  (via drill 0.3)
  Top 0.3: K1.38 54.05,53.77 52.09,55.73 48.87,55.73 45.8,58.8 45.8,61.48 45.5,61.78 39.5,67.78 v39.5,68.28 | v39.5,75 36.5,78 v36.1,78 | v31.3,78 25.8,78 25.45,78.35 22.98,78.35 CTRL2.18 22.79,78.5 2.78,78.5 CTRL1.18
  Bottom 0.3: v39.5,75 v39.5,68.28 | v36.1,78 v31.3,78
GPIO23  (via drill 0.3)
  Top 0.3: R18.1 7.02,77 v1.5,77
  Bottom 0.3: K1.16 25.85,54.07 25.85,64.65 21,69.5 7,69.5 3.25,73.25 CTRL1.8 1.5,74.36 v1.5,77
I2C1_SCL  (via drill 0.3)
  Top 0.18: U2.D2 20.92,63.27
  Top 0.2: 20.92,63.27 20.87,63.27 | U2.D2
  Top 0.3: U6.3 53.45,24.85 53.8,24.5 55.52,24.5 R14.1 56.98,24 61.27,24 OLED.3 | v20,62.5 20.1,62.5 20.87,63.27
  Bottom 0.3: OLED.3 62.5,26.23 56.95,26.23 47.95,35.23 47.95,43.05 44,47 39,47 17.68,47 K1.5 14.72,52.5 16,52.5 16.43,52.5 17.27,53.34 17.27,54.41 20,57.15 v20,62.5
I2C1_SDA  (via drill 0.3)
  Top 0.18: U2.C2 21.32,62.83
  Top 0.2: 21.32,62.83 21.3,62.8
  Top 0.3: U6.4 54.6,25.4 55.2,26 56.98,26 R15.1 59.36,24.98 v60,25.63 | 21.3,62.8 20.3,61.8 19.3,61.8 v19,61.5
  Bottom 0.3: OLED.4 62.44,23.19 v60,25.63 59.85,25.78 56.56,25.78 47.49,34.85 47.49,42.6 43.6,46.5 15.64,46.5 K1.3 12.18,52.5 14,52.5 14.93,53.43 14.93,54.41 19,58.48 v19,61.5
LED  (via drill 0.3)
  Top 0.18: U2.D1 20.48,64.17
  Top 0.2: 20.48,64.17 v19.32,64.17
  Bottom 0.5: LED2.1 6.65,62 8.82,64.17 | v19.32,64.17 8.82,64.17 | LED1.1 5.1,67.9 8.82,64.17
LED1OUT
  Top 0.5: LED1.2 7,65.36 9.14,67.5 U5.S1
LED2OUT
  Top 0.5: U5.D1 10.3,66.26 LED2.2
N$3  (via drill 0.3)
  Top 0.3: R3.1 53.65,43.37 U1.7 57.37,43.37 v58,44
  Bottom 0.3: v58,44 WP.2
N$5
  Top 0.152: U2.B2 21.68,63.08 21.75,63
  Top 0.25: 21.75,63 21.75,61.75 STROBE.TP
N$6
  Top 0.3: D1.2 50,63.2 C3.2
  Top 0.4: Q3.4 51.83,64.6 50.35,63.12 C3.2 50,61.08 R4.2
N$8  (via drill 0.3)
  Top 0.4: D2.A 29,5.47 v29,7.5 | v21,7.5 21,7.4 Q1.3
  Bottom 0.4: FAN.GND 29.5,8 v29,7.5 v21,7.5 J3.2
N$10
  Top 0.3: C13.1 R8.2
N$12
  Top 0.4: R10.2 11.87,59.98 U4.D2 12.05,58
  Top 0.5: 12.05,58 Q2.1
N$14
  Top 0.4: C12.1 R6.1
N$15
  Top 0.6: U4.G2 U4.S2 U4.G1 13.95,63.93 R9.2
N$16  (via drill 0.3)
  Top 0.4: v35.5,2.92 35.5,3.02 D2.C 34,4.53 v34,6
  Bottom 0.4: J2.2 v35.5,2.92 | FAN.5V 33,7 v34,6
N$17
  Top 0.4: R12.2 R11.2 15.43,5.02 Q1.1
N$18  (via drill 0.3)
  Top 0.3: R11.1 15.49,1.49 37.99,1.49 v40,3.5
  Bottom 0.3: v40,3.5 40.19,3.69 J1.1
N$19
  Bottom 0.3: FAN.PWM 39,6 40.81,6 J1.3
N$20
  Top 0.5: D3.C 55.5,33.48 R20.2
N$21
  Top 0.4: U6.8 49.98,28.27 R13.1
N$25
  Top 0.25: Q4.1 16.03,66.48 R17.2
RT
  Top 0.5: U3.4 53.31,73.19 C11.1
SPI0_CE0  (via drill 0.3)
  Top 0.3: K1.24 35.77,53.77 34.71,54.83 32.71,54.83 32.12,55.42 v27.32,55.42
  Bottom 0.3: v27.32,55.42 27.32,55.82 27.02,56.12 27.02,65.48 22.39,70.11 15.5,70.11 12.04,70.11 10.23,71.92 CTRL1.5
SPI0_CE1  (via drill 0.3)
  Top 0.3: K1.26 37.12,55.5 v33.5,55.5
  Bottom 0.3: v33.5,55.5 33,56 33,70.84 30.59,73.25 CTRL2.5
SPI0_MISO
  Top 0.2: 25,74.78 21.95,74.78
  Top 0.3: 21.95,74.78 21.39,75.34 14.86,75.34 CTRL1.4 | 25,74.78 31.59,74.78 CTRL2.4
  Bottom 0.3: K1.21 33.77,51.27 35,52.5 35,60.5 33.5,62 33.5,72.88 33.49,72.88 CTRL2.4
SPI0_MOSI  (via drill 0.3)
  Top 0.2: CTRL2.7 24.39,74.36 20.59,74.36
  Top 0.3: 20.59,74.36 20.2,74.76 v17.6,74.76
  Bottom 0.3: K1.19 30,52.46 30,54.5 28.5,56 28.5,66.5 25.49,69.51 25.49,73.24 CTRL2.7 | v17.6,74.76 6.66,74.76 CTRL1.7
SPI0_SCLK  (via drill 0.3)
  Top 0.3: CTRL1.6 9.64,71.3 v12.4,71.3 | v22.5,71.3 26.09,71.3 CTRL2.6
  Bottom 0.3: K1.23 35.27,51.23 34.21,50.17 33.33,50.17 32.5,50.99 32.5,56 29,59.5 29,72.3 28.05,73.25 CTRL2.6 | v12.4,71.3 v22.5,71.3
SW
  pour Top (isolate 0.5, no thermals): 63.5,81.6 58,81.6 58,78.7 63.5,78.7
VBACKUP
  Top 0.4: U6.6 53.45,28.32 C21.1
  Top 0.5: C21.1 53.75,29.23 C23.1 55.5,37.25 R20.1
VIN
  Top 0.5: Q3.6 Q3.9
  pour Top (isolate 0.5, no thermals): 51,59.3 51,63.3 61.5,63.3 61.5,59.3

### Text on the board
tNames: TMC5160 / SilentStepStick | TMC5160 / SilentStepStick | - | + | - | + | - | + | + | - | GND | 3V3 | SCL | SDA | Planktoscope / HAT | v0.2 - rc1 / 2021-02-28 | CERN / OHL-S / 2.0
bNames: designed by / Romain BAZILE / for | PlanktonPlanet | D | IC | +5V | +12V
Document: GND | Vio | BMB2 | BMB1 | BMA1 | BMA2 | GND | Vm | DIAG1 | DIAG0 | Dir | Step | DCO | SDO/CFG0 | CSN/CFG3 | SCK/CFG2 | SDI/CFG1 | EN | GND | Vio | BMB2 | BMB1 | BMA1 | BMA2 | GND | Vm | DIAG1 | DIAG0 | Dir | Step | DCO | SDO/CFG0 | CSN/CFG3 | SCK/CFG2 | SDI/CFG1 | EN